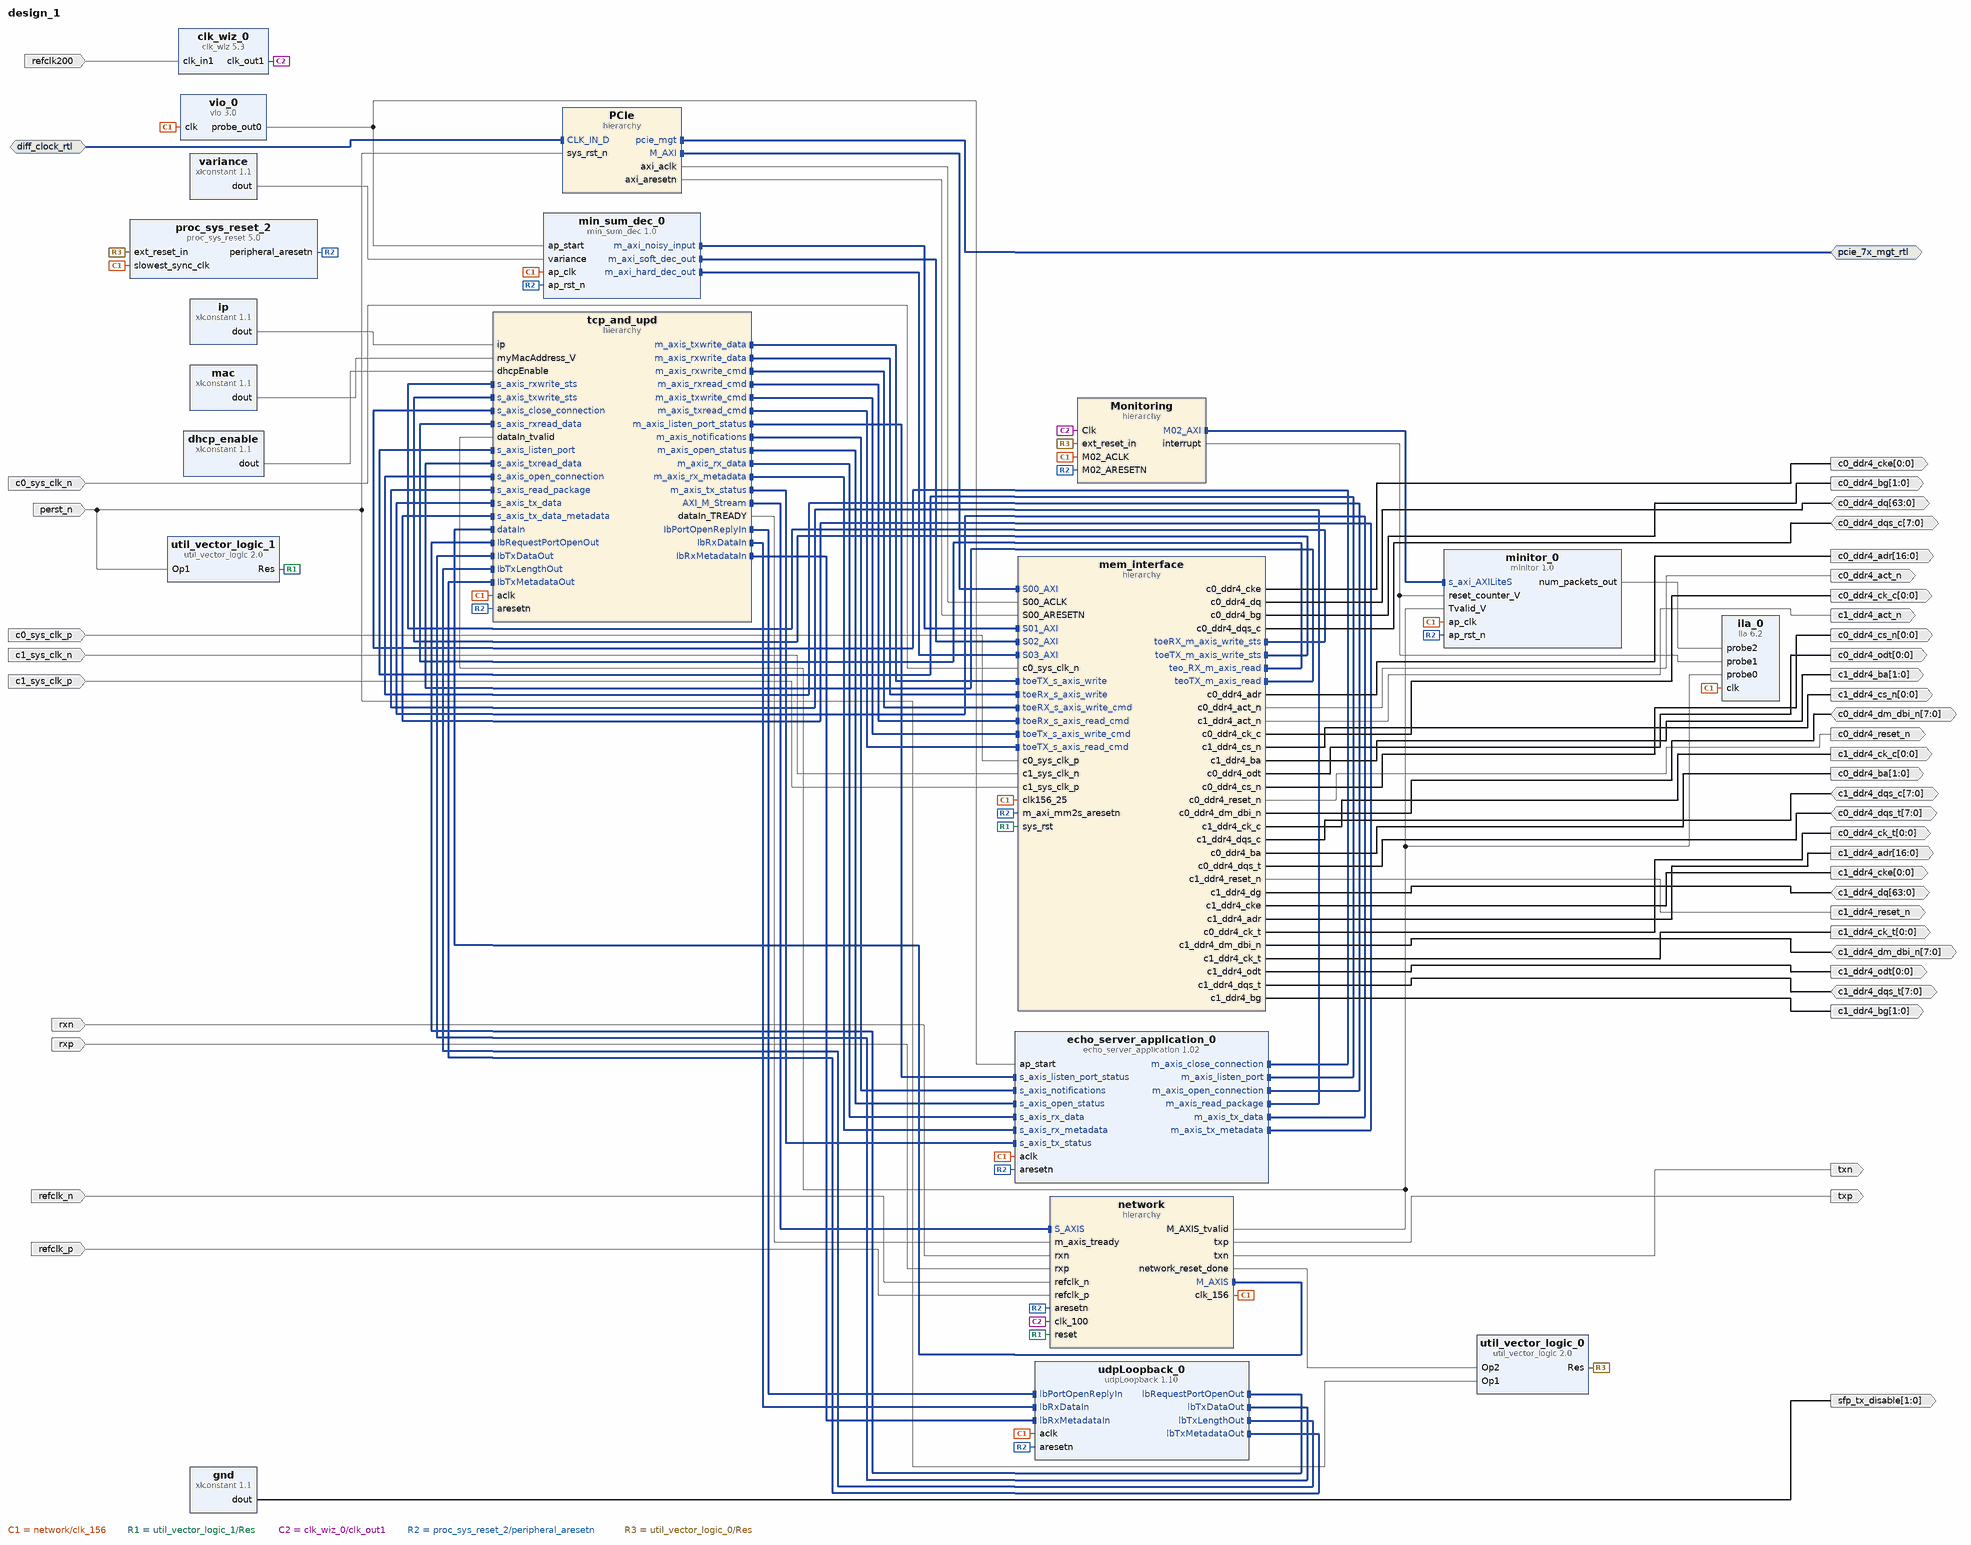
[diagram p0: block diagram of the top level]
# Vivado block design design_1, xcku115-flva1517-2-e, Vivado 2016.3
create_bd_design design_1

create_bd_intf_port -mode Master -vlnv xilinx.com:interface:pcie_7x_mgt_rtl:1.0 pcie_7x_mgt_rtl
create_bd_intf_port -mode Slave -vlnv xilinx.com:interface:diff_clock_rtl:1.0 diff_clock_rtl
set_property -dict {CONFIG.FREQ_HZ 100000000} [get_bd_intf_ports diff_clock_rtl]
create_bd_port -dir I rxn
create_bd_port -dir I rxp
create_bd_port -dir I refclk_n
create_bd_port -dir O txp
create_bd_port -dir O txn
create_bd_port -dir I refclk_p
create_bd_port -dir I perst_n
create_bd_port -dir I -type clk refclk200
set_property -dict {CONFIG.FREQ_HZ 200000000} [get_bd_ports refclk200]
create_bd_port -dir O -from 1 -to 0 sfp_tx_disable
create_bd_port -dir O -from 0 -to 0 c0_ddr4_cke
create_bd_port -dir IO -from 63 -to 0 c0_ddr4_dq
create_bd_port -dir IO -from 7 -to 0 c0_ddr4_dqs_c
create_bd_port -dir O c1_ddr4_reset_n
create_bd_port -dir IO -from 7 -to 0 c1_ddr4_dqs_c
create_bd_port -dir O -from 0 -to 0 c1_ddr4_cs_n
create_bd_port -dir O -from 1 -to 0 c0_ddr4_bg
create_bd_port -dir O c1_ddr4_act_n
create_bd_port -dir O -from 1 -to 0 c1_ddr4_ba
create_bd_port -dir I -type clk c0_sys_clk_n
create_bd_port -dir IO -from 63 -to 0 c1_ddr4_dq
create_bd_port -dir O -from 0 -to 0 -type clk c1_ddr4_ck_c
create_bd_port -dir O -from 0 -to 0 c1_ddr4_cke
create_bd_port -dir I -type clk c0_sys_clk_p
create_bd_port -dir O -from 16 -to 0 c0_ddr4_adr
create_bd_port -dir O -from 0 -to 0 c0_ddr4_odt
create_bd_port -dir O c0_ddr4_reset_n
create_bd_port -dir O c0_ddr4_act_n
create_bd_port -dir O -from 0 -to 0 -type clk c0_ddr4_ck_c
create_bd_port -dir I -type clk c1_sys_clk_n
create_bd_port -dir IO -from 7 -to 0 c1_ddr4_dm_dbi_n
create_bd_port -dir O -from 0 -to 0 c0_ddr4_cs_n
create_bd_port -dir O -from 16 -to 0 c1_ddr4_adr
create_bd_port -dir O -from 0 -to 0 c1_ddr4_odt
create_bd_port -dir IO -from 7 -to 0 c0_ddr4_dm_dbi_n
create_bd_port -dir O -from 0 -to 0 -type clk c1_ddr4_ck_t
create_bd_port -dir IO -from 7 -to 0 c0_ddr4_dqs_t
create_bd_port -dir I -type clk c1_sys_clk_p
create_bd_port -dir IO -from 7 -to 0 c1_ddr4_dqs_t
create_bd_port -dir O -from 1 -to 0 c1_ddr4_bg
create_bd_port -dir O -from 0 -to 0 -type clk c0_ddr4_ck_t
create_bd_port -dir O -from 1 -to 0 c0_ddr4_ba

create_bd_cell -type hier tcp_and_upd
create_bd_cell -type hier network
create_bd_cell -type ip -vlnv xilinx.labs:hls:echo_server_application:1.02 echo_server_application_0
create_bd_cell -type ip -vlnv xilinx.com:ip:util_vector_logic:2.0 util_vector_logic_0
set_property -dict {CONFIG.C_SIZE 1} [get_bd_cells util_vector_logic_0]
create_bd_cell -type ip -vlnv xilinx.com:ip:util_vector_logic:2.0 util_vector_logic_1
set_property -dict {CONFIG.C_SIZE 1 CONFIG.C_OPERATION not} [get_bd_cells util_vector_logic_1]
create_bd_cell -type ip -vlnv xilinx.com:ip:clk_wiz:5.3 clk_wiz_0
set_property -dict {CONFIG.USE_LOCKED false CONFIG.USE_RESET false} [get_bd_cells clk_wiz_0]
create_bd_cell -type ip -vlnv xilinx.com:ip:xlconstant:1.1 gnd
set_property -dict {CONFIG.CONST_WIDTH 2 CONFIG.CONST_VAL 0} [get_bd_cells gnd]
create_bd_cell -type ip -vlnv xilinx.com:ip:xlconstant:1.1 ip
set_property -dict {CONFIG.CONST_WIDTH 32 CONFIG.CONST_VAL 16843009} [get_bd_cells ip]
create_bd_cell -type ip -vlnv xilinx.com:ip:xlconstant:1.1 mac
set_property -dict {CONFIG.CONST_WIDTH 48 CONFIG.CONST_VAL 252462509656576} [get_bd_cells mac]
create_bd_cell -type ip -vlnv xilinx.com:ip:xlconstant:1.1 dhcp_enable
set_property -dict {CONFIG.CONST_VAL 0} [get_bd_cells dhcp_enable]
create_bd_cell -type ip -vlnv xilinx.com:ip:proc_sys_reset:5.0 proc_sys_reset_2
create_bd_cell -type ip -vlnv xilinx.com:ip:vio:3.0 vio_0
set_property -dict {CONFIG.C_NUM_PROBE_IN 0} [get_bd_cells vio_0]
create_bd_cell -type hier mem_interface
create_bd_cell -type hier PCIe
create_bd_cell -type hier Monitoring
create_bd_cell -type ip -vlnv xilinx.com:hls:min_sum_dec:1.0 min_sum_dec_0
set_property -dict [list \
  CONFIG.C_M_AXI_NOISY_INPUT_TARGET_ADDR 0x00000204 \
  CONFIG.C_M_AXI_SOFT_DEC_OUT_TARGET_ADDR 0x000011AC \
  CONFIG.C_M_AXI_HARD_DEC_OUT_TARGET_ADDR 0x00002154 \
] [get_bd_cells min_sum_dec_0]
create_bd_cell -type ip -vlnv xilinx.com:ip:xlconstant:1.1 variance
set_property -dict {CONFIG.CONST_WIDTH 32 CONFIG.CONST_VAL 1061902616} [get_bd_cells variance]
create_bd_cell -type ip -vlnv xilinx.labs:hls:udpLoopback:1.10 udpLoopback_0
create_bd_cell -type ip -vlnv xilinx.com:ip:ila:6.2 ila_0
set_property -dict [list \
  CONFIG.C_PROBE2_WIDTH 32 \
  CONFIG.C_NUM_OF_PROBES 3 \
  CONFIG.C_ENABLE_ILA_AXI_MON false \
  CONFIG.C_MONITOR_TYPE Native \
] [get_bd_cells ila_0]
create_bd_cell -type ip -vlnv xilinx.com:hls:minitor:1.0 minitor_0

# ---- hierarchy /tcp_and_upd ----
current_bd_instance /tcp_and_upd
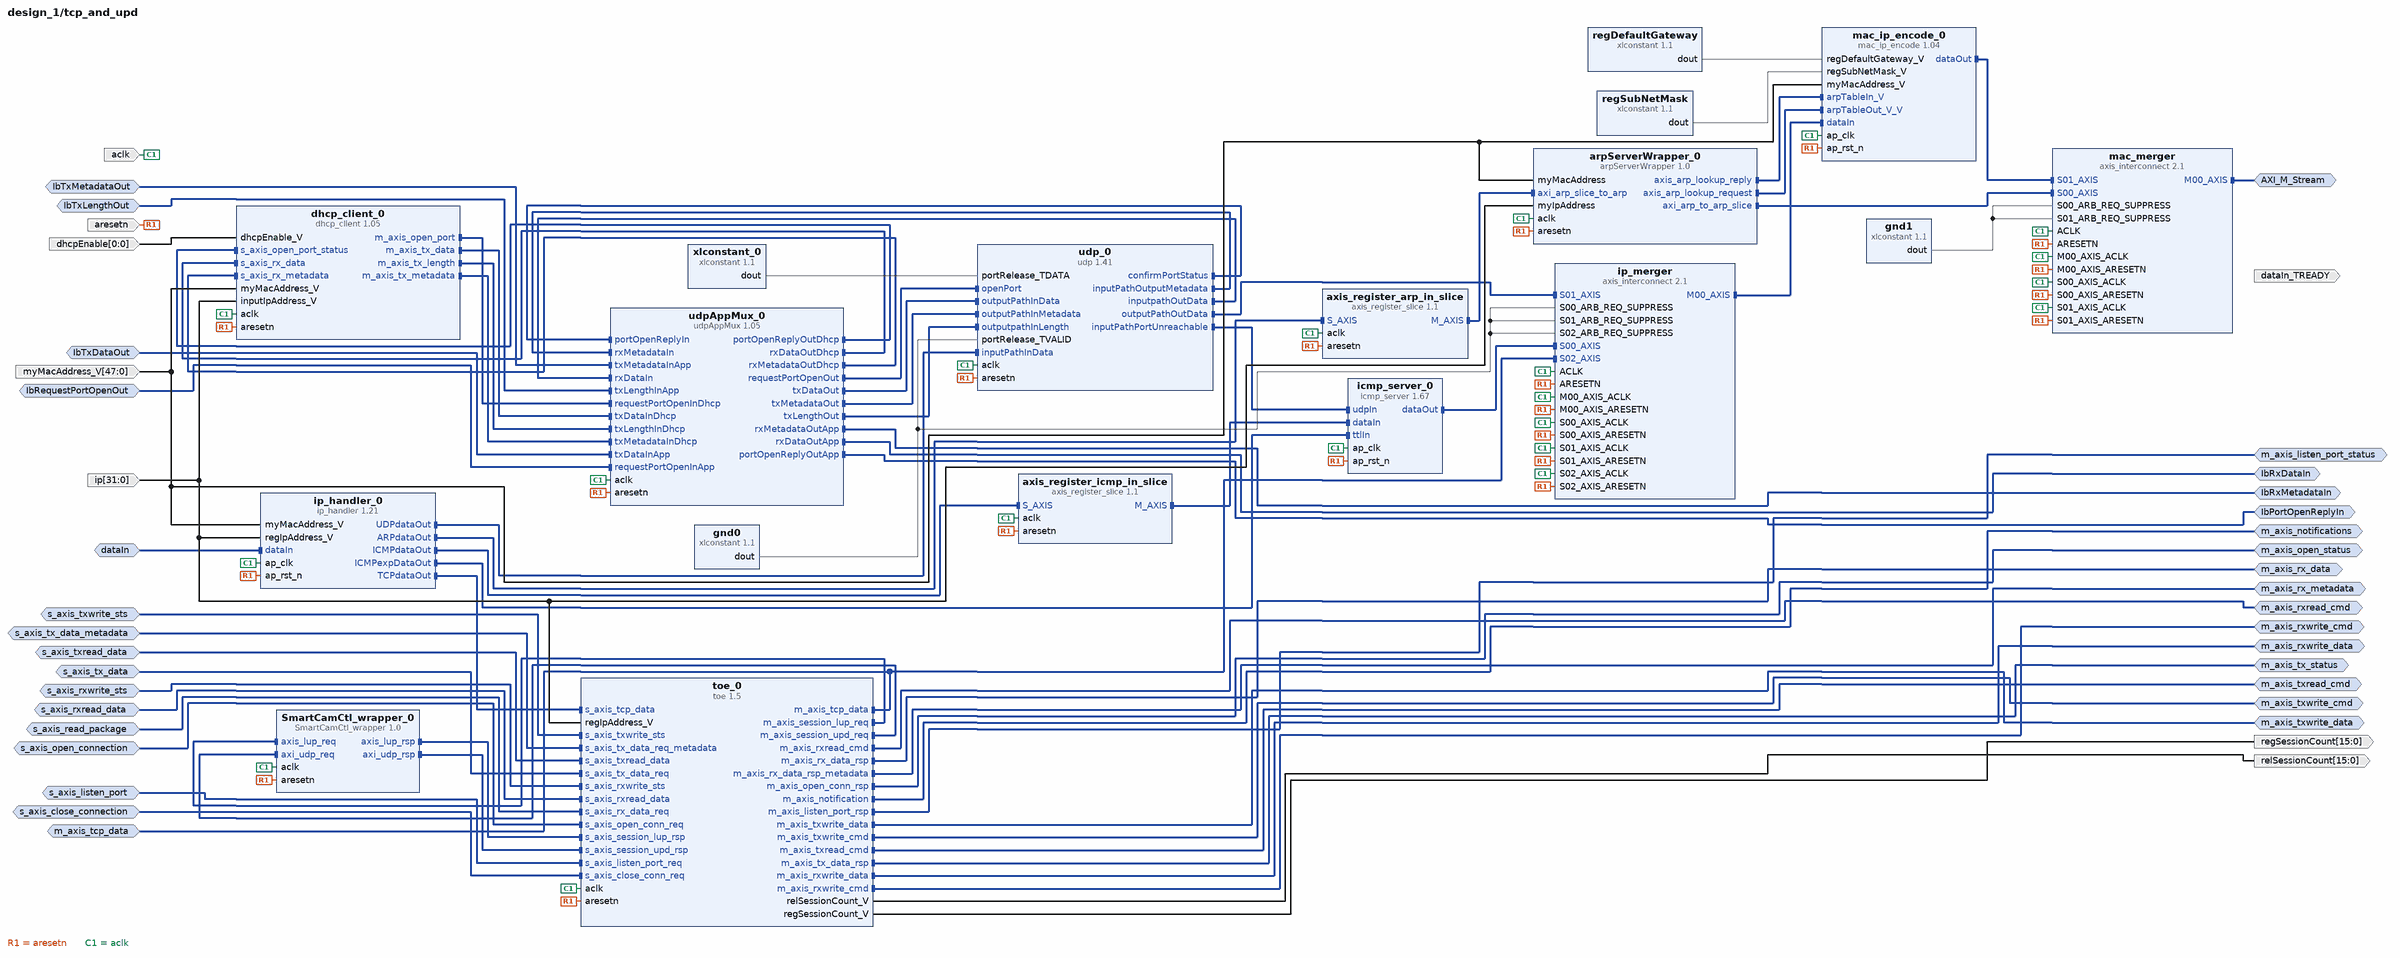
[diagram p1: block diagram inside /tcp_and_upd]
create_bd_intf_pin -mode Master -vlnv xilinx.com:interface:axis_rtl:1.0 m_axis_rxread_cmd
create_bd_intf_pin -mode Master -vlnv xilinx.com:interface:axis_rtl:1.0 m_axis_rx_data
create_bd_intf_pin -mode Master -vlnv xilinx.com:interface:axis_rtl:1.0 m_axis_rx_metadata
create_bd_intf_pin -mode Master -vlnv xilinx.com:interface:axis_rtl:1.0 m_axis_open_status
create_bd_intf_pin -mode Master -vlnv xilinx.com:interface:axis_rtl:1.0 m_axis_notifications
create_bd_intf_pin -mode Master -vlnv xilinx.com:interface:axis_rtl:1.0 m_axis_listen_port_status
create_bd_intf_pin -mode Slave -vlnv xilinx.com:interface:axis_rtl:1.0 s_axis_txwrite_sts
create_bd_intf_pin -mode Slave -vlnv xilinx.com:interface:axis_rtl:1.0 s_axis_tx_data_metadata
create_bd_intf_pin -mode Master -vlnv xilinx.com:interface:axis_rtl:1.0 m_axis_txwrite_data
create_bd_intf_pin -mode Master -vlnv xilinx.com:interface:axis_rtl:1.0 m_axis_txwrite_cmd
create_bd_intf_pin -mode Master -vlnv xilinx.com:interface:axis_rtl:1.0 m_axis_txread_cmd
create_bd_intf_pin -mode Master -vlnv xilinx.com:interface:axis_rtl:1.0 m_axis_tx_status
create_bd_intf_pin -mode Master -vlnv xilinx.com:interface:axis_rtl:1.0 m_axis_rxwrite_data
create_bd_intf_pin -mode Master -vlnv xilinx.com:interface:axis_rtl:1.0 m_axis_rxwrite_cmd
create_bd_intf_pin -mode Master -vlnv xilinx.com:interface:axis_rtl:1.0 IbRxMetadataIn
create_bd_intf_pin -mode Master -vlnv xilinx.com:interface:axis_rtl:1.0 IbRxDataIn
create_bd_intf_pin -mode Master -vlnv xilinx.com:interface:axis_rtl:1.0 IbPortOpenReplyIn
create_bd_intf_pin -mode Slave -vlnv xilinx.com:interface:axis_rtl:1.0 IbTxMetadataOut
create_bd_intf_pin -mode Slave -vlnv xilinx.com:interface:axis_rtl:1.0 IbTxLengthOut
create_bd_intf_pin -mode Slave -vlnv xilinx.com:interface:axis_rtl:1.0 IbTxDataOut
create_bd_intf_pin -mode Slave -vlnv xilinx.com:interface:axis_rtl:1.0 IbRequestPortOpenOut
create_bd_intf_pin -mode Slave -vlnv xilinx.com:interface:axis_rtl:1.0 s_axis_txread_data
create_bd_intf_pin -mode Slave -vlnv xilinx.com:interface:axis_rtl:1.0 s_axis_tx_data
create_bd_intf_pin -mode Slave -vlnv xilinx.com:interface:axis_rtl:1.0 s_axis_rxwrite_sts
create_bd_intf_pin -mode Slave -vlnv xilinx.com:interface:axis_rtl:1.0 s_axis_rxread_data
create_bd_intf_pin -mode Slave -vlnv xilinx.com:interface:axis_rtl:1.0 s_axis_read_package
create_bd_intf_pin -mode Slave -vlnv xilinx.com:interface:axis_rtl:1.0 s_axis_open_connection
create_bd_intf_pin -mode Slave -vlnv xilinx.com:interface:axis_rtl:1.0 s_axis_listen_port
create_bd_intf_pin -mode Slave -vlnv xilinx.com:interface:axis_rtl:1.0 s_axis_close_connection
create_bd_intf_pin -mode Master -vlnv xilinx.com:interface:axis_rtl:1.0 AXI_M_Stream
create_bd_intf_pin -mode Monitor -vlnv xilinx.com:interface:axis_rtl:1.0 m_axis_tcp_data
create_bd_intf_pin -mode Slave -vlnv xilinx.com:interface:axis_rtl:1.0 dataIn
create_bd_pin -dir I -type rst aresetn
create_bd_pin -dir I -type clk aclk
create_bd_pin -dir I -from 47 -to 0 myMacAddress_V
create_bd_pin -dir I -from 0 -to 0 dhcpEnable
create_bd_pin -dir O -from 15 -to 0 relSessionCount
create_bd_pin -dir I -from 31 -to 0 ip
create_bd_pin -dir O -from 15 -to 0 regSessionCount
create_bd_pin -dir O dataIn_TREADY

create_bd_cell -type ip -vlnv xilinx.com:ip:xlconstant:1.1 gnd1
set_property -dict {CONFIG.CONST_VAL 0} [get_bd_cells gnd1]
create_bd_cell -type ip -vlnv xilinx.labs:hls:udp:1.41 udp_0
create_bd_cell -type ip -vlnv xilinx.com:ip:axis_register_slice:1.1 axis_register_icmp_in_slice
create_bd_cell -type ip -vlnv xilinx.labs:hls:ip_handler:1.21 ip_handler_0
create_bd_cell -type ip -vlnv xilinx.com:ip:xlconstant:1.1 regDefaultGateway
set_property -dict {CONFIG.CONST_WIDTH 32 CONFIG.CONST_VAL 16843009} [get_bd_cells regDefaultGateway]
create_bd_cell -type ip -vlnv xilinx.com:ip:axis_interconnect:2.1 mac_merger
set_property -dict [list \
  CONFIG.NUM_SI 2 \
  CONFIG.NUM_MI 1 \
  CONFIG.HAS_ACLKEN 0 \
  CONFIG.ENABLE_ADVANCED_OPTIONS 1 \
  CONFIG.ENABLE_FIFO_COUNT_PORTS 0 \
  CONFIG.ARB_ON_MAX_XFERS 0 \
  CONFIG.ARB_ON_TLAST 1 \
  CONFIG.M00_HAS_REGSLICE 1 \
  CONFIG.S00_HAS_REGSLICE 1 \
  CONFIG.S01_HAS_REGSLICE 1 \
] [get_bd_cells mac_merger]
create_bd_cell -type ip -vlnv xilinx.labs:hls:udpAppMux:1.05 udpAppMux_0
create_bd_cell -type ip -vlnv xilinx.labs:hls:icmp_server:1.67 icmp_server_0
create_bd_cell -type ip -vlnv xilinx.labs:hls:dhcp_client:1.05 dhcp_client_0
create_bd_cell -type ip -vlnv xilinx.com:ip:xlconstant:1.1 regSubNetMask
set_property -dict {CONFIG.CONST_WIDTH 32 CONFIG.CONST_VAL 16777215} [get_bd_cells regSubNetMask]
create_bd_cell -type ip -vlnv xilinx.labs:hls:mac_ip_encode:1.04 mac_ip_encode_0
create_bd_cell -type ip -vlnv xilinx.com:ip:axis_register_slice:1.1 axis_register_arp_in_slice
create_bd_cell -type ip -vlnv xilinx.com:ip:xlconstant:1.1 gnd0
set_property -dict {CONFIG.CONST_VAL 0} [get_bd_cells gnd0]
create_bd_cell -type ip -vlnv xilinx.com:ip:axis_interconnect:2.1 ip_merger
set_property -dict [list \
  CONFIG.NUM_SI 3 \
  CONFIG.NUM_MI 1 \
  CONFIG.HAS_ACLKEN 0 \
  CONFIG.ENABLE_ADVANCED_OPTIONS 1 \
  CONFIG.ENABLE_FIFO_COUNT_PORTS 0 \
  CONFIG.ARB_ON_TLAST 1 \
  CONFIG.S00_HAS_REGSLICE 1 \
  CONFIG.S01_HAS_REGSLICE 1 \
  CONFIG.S02_HAS_REGSLICE 1 \
] [get_bd_cells ip_merger]
create_bd_cell -type ip -vlnv xilinx.labs:hls:toe:1.5 toe_0
create_bd_cell -type ip -vlnv xilinx.com:ip:xlconstant:1.1 xlconstant_0
set_property -dict {CONFIG.CONST_WIDTH 16} [get_bd_cells xlconstant_0]
create_bd_cell -type ip -vlnv user.org:user:arpServerWrapper:1.0 arpServerWrapper_0
create_bd_cell -type ip -vlnv user.org:user:SmartCamCtl_wrapper:1.0 SmartCamCtl_wrapper_0

# ---- hierarchy /network ----
current_bd_instance /network
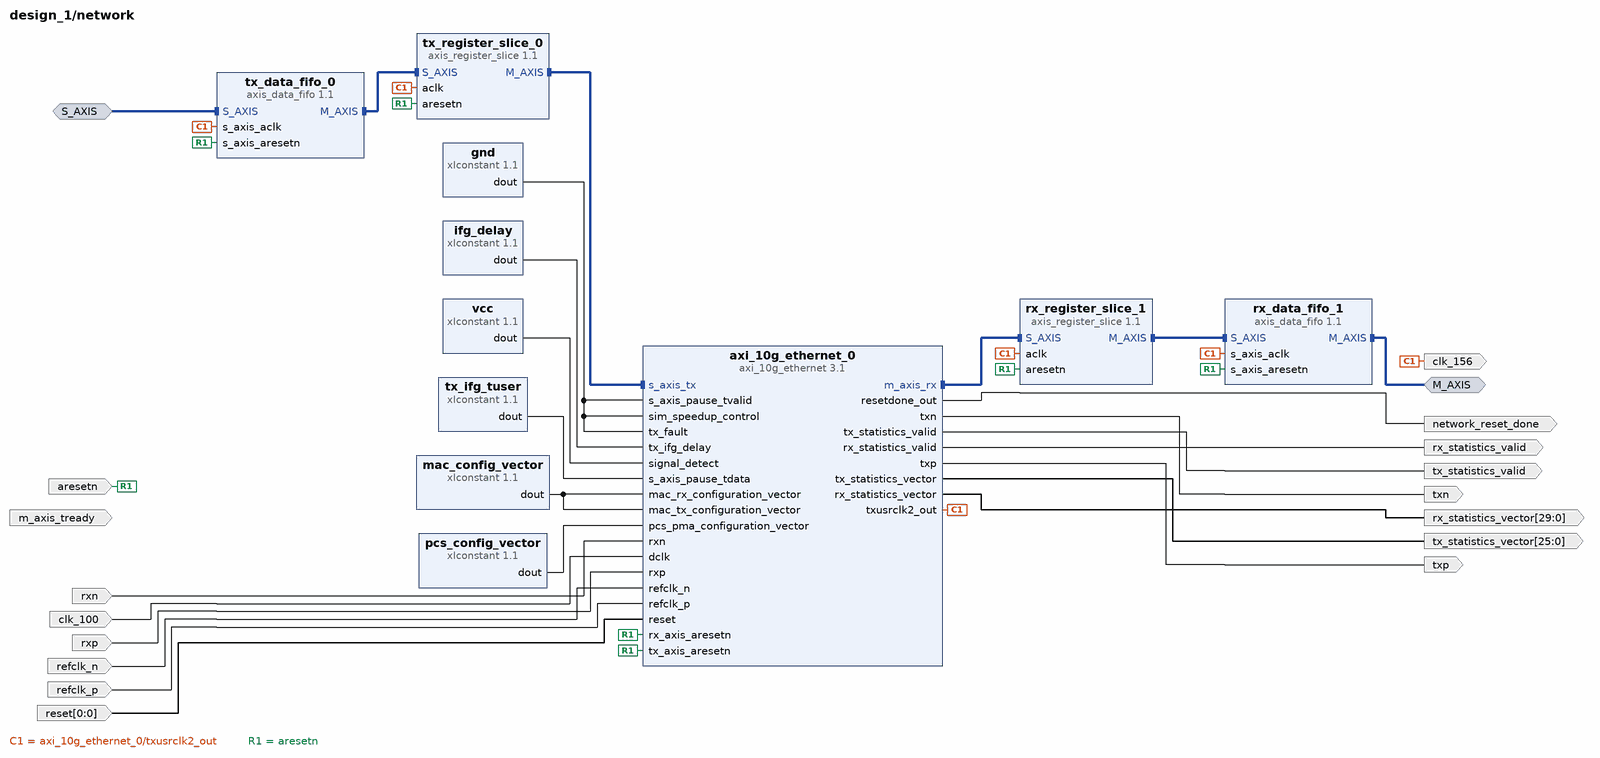
[diagram p2: block diagram inside /network]
create_bd_intf_pin -mode Slave -vlnv xilinx.com:interface:axis_rtl:1.0 S_AXIS
create_bd_intf_pin -mode Master -vlnv xilinx.com:interface:axis_rtl:1.0 M_AXIS
create_bd_pin -dir I rxn
create_bd_pin -dir I -type clk clk_100
create_bd_pin -dir I rxp
create_bd_pin -dir O -type clk clk_156
create_bd_pin -dir I -type rst aresetn
create_bd_pin -dir I refclk_n
create_bd_pin -dir O txp
create_bd_pin -dir O txn
create_bd_pin -dir O network_reset_done
create_bd_pin -dir I refclk_p
create_bd_pin -dir I -from 0 -to 0 -type rst reset
create_bd_pin -dir O tx_statistics_valid
create_bd_pin -dir O -from 25 -to 0 tx_statistics_vector
create_bd_pin -dir O rx_statistics_valid
create_bd_pin -dir O -from 29 -to 0 rx_statistics_vector
create_bd_pin -dir I m_axis_tready

create_bd_cell -type ip -vlnv xilinx.com:ip:xlconstant:1.1 gnd
set_property -dict {CONFIG.CONST_VAL 0} [get_bd_cells gnd]
create_bd_cell -type ip -vlnv xilinx.com:ip:axis_register_slice:1.1 tx_register_slice_0
set_property -dict {CONFIG.TUSER_WIDTH 0} [get_bd_cells tx_register_slice_0]
create_bd_cell -type ip -vlnv xilinx.com:ip:axi_10g_ethernet:3.1 axi_10g_ethernet_0
set_property -dict [list \
  CONFIG.Management_Interface false \
  CONFIG.base_kr BASE-R \
  CONFIG.SupportLevel 1 \
  CONFIG.Locations X1Y16 \
] [get_bd_cells axi_10g_ethernet_0]
create_bd_cell -type ip -vlnv xilinx.com:ip:xlconstant:1.1 mac_config_vector
set_property -dict {CONFIG.CONST_WIDTH 80 CONFIG.CONST_VAL 22} [get_bd_cells mac_config_vector]
create_bd_cell -type ip -vlnv xilinx.com:ip:xlconstant:1.1 tx_ifg_tuser
set_property -dict {CONFIG.CONST_WIDTH 16 CONFIG.CONST_VAL 0} [get_bd_cells tx_ifg_tuser]
create_bd_cell -type ip -vlnv xilinx.com:ip:xlconstant:1.1 ifg_delay
set_property -dict {CONFIG.CONST_WIDTH 8 CONFIG.CONST_VAL 0} [get_bd_cells ifg_delay]
create_bd_cell -type ip -vlnv xilinx.com:ip:xlconstant:1.1 vcc
create_bd_cell -type ip -vlnv xilinx.com:ip:xlconstant:1.1 pcs_config_vector
set_property -dict {CONFIG.CONST_WIDTH 536 CONFIG.CONST_VAL 0} [get_bd_cells pcs_config_vector]
create_bd_cell -type ip -vlnv xilinx.com:ip:axis_register_slice:1.1 rx_register_slice_1
set_property -dict {CONFIG.TUSER_WIDTH 0} [get_bd_cells rx_register_slice_1]
create_bd_cell -type ip -vlnv xilinx.com:ip:axis_data_fifo:1.1 rx_data_fifo_1
set_property -dict {CONFIG.FIFO_MODE 2} [get_bd_cells rx_data_fifo_1]
create_bd_cell -type ip -vlnv xilinx.com:ip:axis_data_fifo:1.1 tx_data_fifo_0
set_property -dict {CONFIG.FIFO_MODE 2} [get_bd_cells tx_data_fifo_0]

# ---- hierarchy /mem_interface ----
current_bd_instance /mem_interface
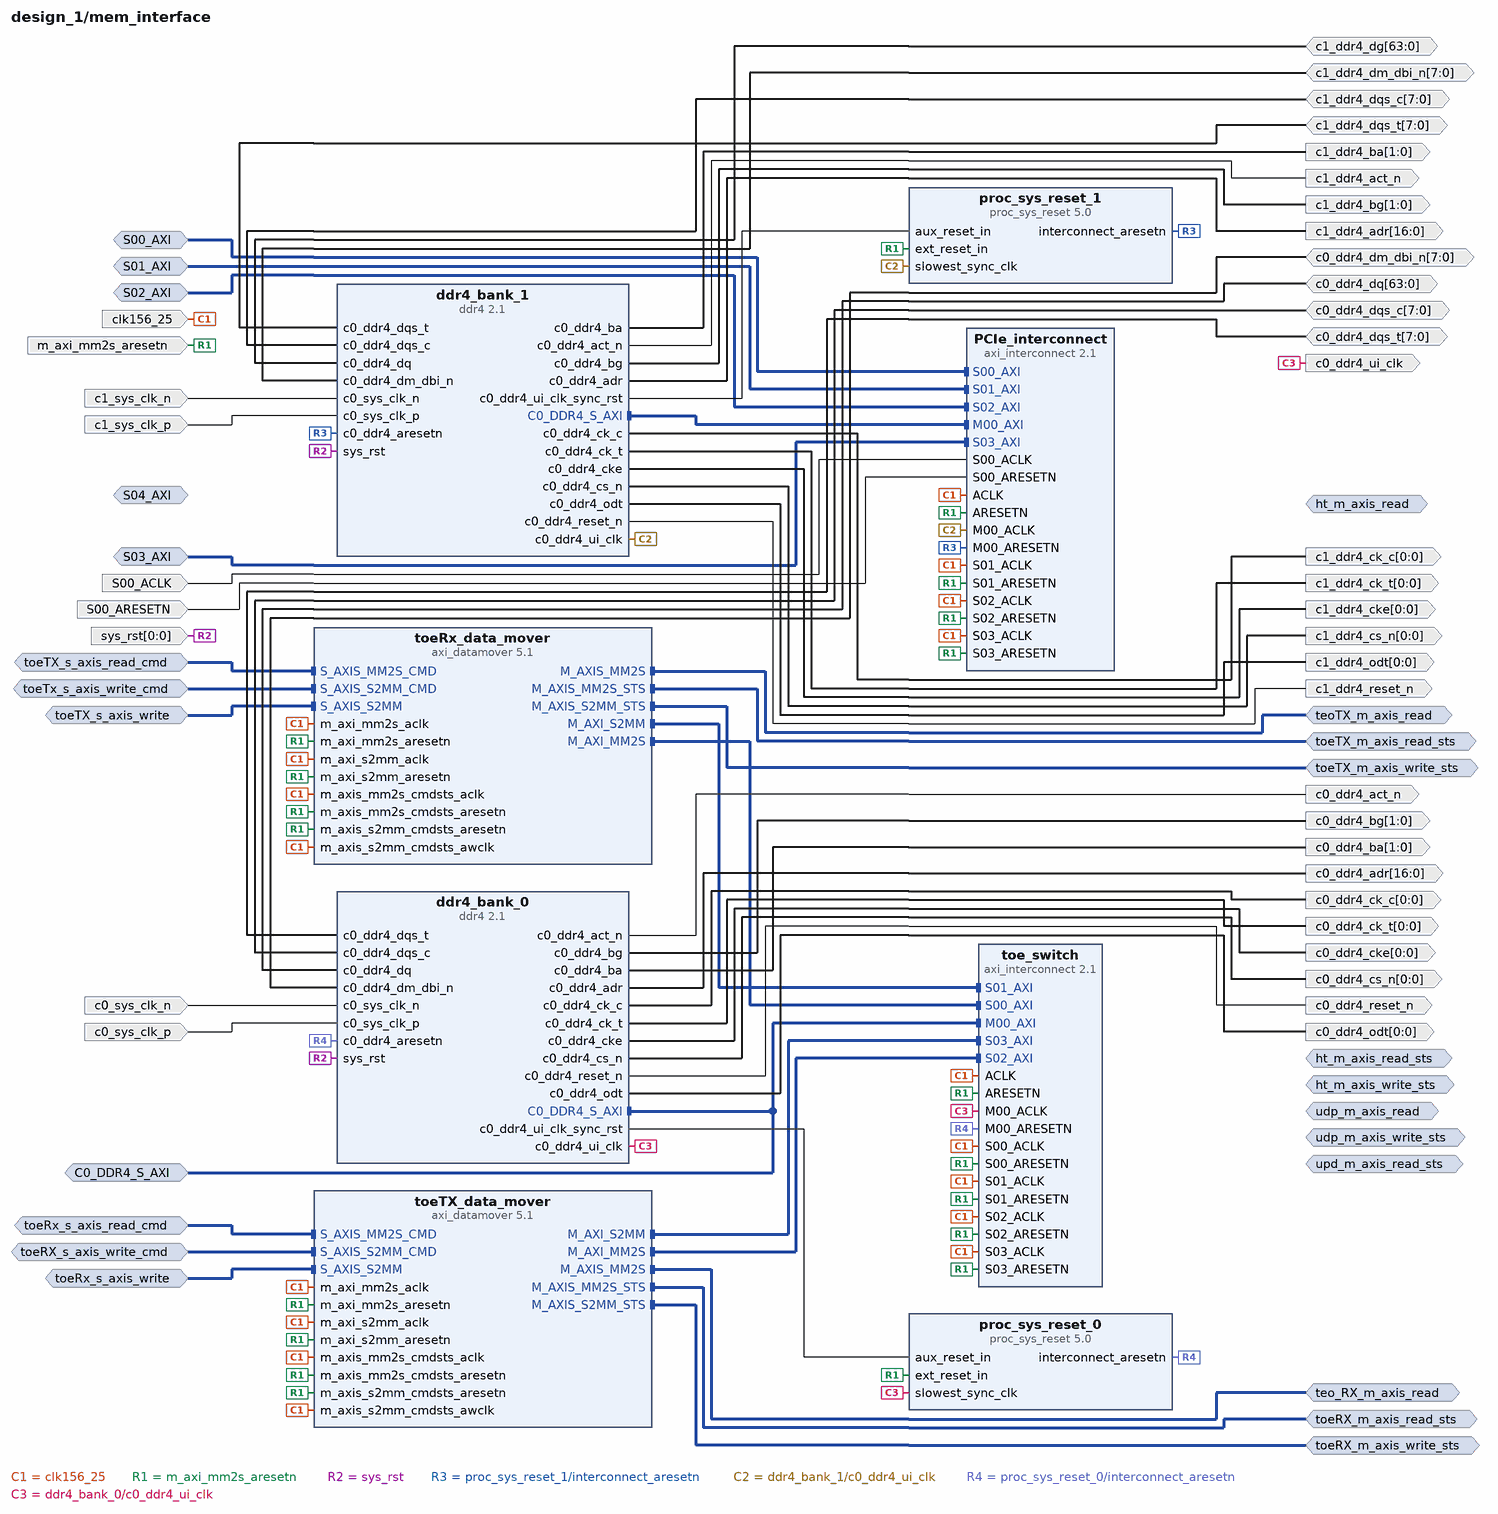
[diagram p3: block diagram inside /mem_interface]
create_bd_intf_pin -mode Master -vlnv xilinx.com:interface:axis_rtl:1.0 teoTX_m_axis_read
create_bd_intf_pin -mode Master -vlnv xilinx.com:interface:axis_rtl:1.0 toeTX_m_axis_read_sts
create_bd_intf_pin -mode Slave -vlnv xilinx.com:interface:axis_rtl:1.0 toeTX_s_axis_read_cmd
create_bd_intf_pin -mode Master -vlnv xilinx.com:interface:axis_rtl:1.0 toeTX_m_axis_write_sts
create_bd_intf_pin -mode Slave -vlnv xilinx.com:interface:axis_rtl:1.0 toeTx_s_axis_write_cmd
create_bd_intf_pin -mode Slave -vlnv xilinx.com:interface:axis_rtl:1.0 toeTX_s_axis_write
create_bd_intf_pin -mode Master -vlnv xilinx.com:interface:axis_rtl:1.0 udp_m_axis_read
create_bd_intf_pin -mode Master -vlnv xilinx.com:interface:axis_rtl:1.0 upd_m_axis_read_sts
create_bd_intf_pin -mode Master -vlnv xilinx.com:interface:axis_rtl:1.0 udp_m_axis_write_sts
create_bd_intf_pin -mode Master -vlnv xilinx.com:interface:axis_rtl:1.0 ht_m_axis_read
create_bd_intf_pin -mode Master -vlnv xilinx.com:interface:axis_rtl:1.0 ht_m_axis_read_sts
create_bd_intf_pin -mode Master -vlnv xilinx.com:interface:axis_rtl:1.0 ht_m_axis_write_sts
create_bd_intf_pin -mode Master -vlnv xilinx.com:interface:axis_rtl:1.0 teo_RX_m_axis_read
create_bd_intf_pin -mode Master -vlnv xilinx.com:interface:axis_rtl:1.0 toeRX_m_axis_read_sts
create_bd_intf_pin -mode Slave -vlnv xilinx.com:interface:axis_rtl:1.0 toeRx_s_axis_read_cmd
create_bd_intf_pin -mode Master -vlnv xilinx.com:interface:axis_rtl:1.0 toeRX_m_axis_write_sts
create_bd_intf_pin -mode Slave -vlnv xilinx.com:interface:axis_rtl:1.0 toeRX_s_axis_write_cmd
create_bd_intf_pin -mode Slave -vlnv xilinx.com:interface:axis_rtl:1.0 toeRx_s_axis_write
create_bd_intf_pin -mode Monitor -vlnv xilinx.com:interface:aximm_rtl:1.0 C0_DDR4_S_AXI
create_bd_intf_pin -mode Slave -vlnv xilinx.com:interface:aximm_rtl:1.0 S00_AXI
create_bd_intf_pin -mode Slave -vlnv xilinx.com:interface:aximm_rtl:1.0 S01_AXI
create_bd_intf_pin -mode Slave -vlnv xilinx.com:interface:aximm_rtl:1.0 S02_AXI
create_bd_intf_pin -mode Slave -vlnv xilinx.com:interface:aximm_rtl:1.0 S03_AXI
create_bd_intf_pin -mode Slave -vlnv xilinx.com:interface:aximm_rtl:1.0 S04_AXI
create_bd_pin -dir I -type clk clk156_25
create_bd_pin -dir O c0_ddr4_act_n
create_bd_pin -dir O -from 1 -to 0 c0_ddr4_bg
create_bd_pin -dir O c0_ddr4_reset_n
create_bd_pin -dir O -from 1 -to 0 c0_ddr4_ba
create_bd_pin -dir O -from 0 -to 0 c0_ddr4_odt
create_bd_pin -dir O -from 16 -to 0 c0_ddr4_adr
create_bd_pin -dir O -from 0 -to 0 c0_ddr4_cs_n
create_bd_pin -dir O -from 0 -to 0 c0_ddr4_cke
create_bd_pin -dir O -from 0 -to 0 -type clk c0_ddr4_ck_t
create_bd_pin -dir O -from 0 -to 0 -type clk c0_ddr4_ck_c
create_bd_pin -dir IO -from 7 -to 0 c0_ddr4_dqs_t
create_bd_pin -dir IO -from 7 -to 0 c0_ddr4_dqs_c
create_bd_pin -dir IO -from 63 -to 0 c0_ddr4_dq
create_bd_pin -dir IO -from 7 -to 0 c0_ddr4_dm_dbi_n
create_bd_pin -dir O -from 1 -to 0 c1_ddr4_bg
create_bd_pin -dir O -from 1 -to 0 c1_ddr4_ba
create_bd_pin -dir O -from 0 -to 0 c1_ddr4_odt
create_bd_pin -dir O -from 16 -to 0 c1_ddr4_adr
create_bd_pin -dir O c1_ddr4_act_n
create_bd_pin -dir O -from 0 -to 0 c1_ddr4_cs_n
create_bd_pin -dir O -from 0 -to 0 c1_ddr4_cke
create_bd_pin -dir O -from 0 -to 0 -type clk c1_ddr4_ck_t
create_bd_pin -dir O -from 0 -to 0 -type clk c1_ddr4_ck_c
create_bd_pin -dir IO -from 7 -to 0 c1_ddr4_dqs_t
create_bd_pin -dir IO -from 7 -to 0 c1_ddr4_dqs_c
create_bd_pin -dir IO -from 63 -to 0 c1_ddr4_dg
create_bd_pin -dir IO -from 7 -to 0 c1_ddr4_dm_dbi_n
create_bd_pin -dir O c1_ddr4_reset_n
create_bd_pin -dir I -from 0 -to 0 -type rst sys_rst
create_bd_pin -dir I -type clk c1_sys_clk_n
create_bd_pin -dir I -type clk c1_sys_clk_p
create_bd_pin -dir I -type clk c0_sys_clk_n
create_bd_pin -dir I -type clk c0_sys_clk_p
create_bd_pin -dir I -type rst m_axi_mm2s_aresetn
create_bd_pin -dir O -type clk c0_ddr4_ui_clk
create_bd_pin -dir I -type clk S00_ACLK
create_bd_pin -dir I -type rst S00_ARESETN

create_bd_cell -type ip -vlnv xilinx.com:ip:ddr4:2.1 ddr4_bank_1
set_property -dict [list \
  CONFIG.C0.DDR4_TimePeriod 939 \
  CONFIG.C0.DDR4_InputClockPeriod 3338 \
  CONFIG.C0.DDR4_MemoryPart CUSTOM_DBI_MT40A1G8PM-083E \
  CONFIG.C0.DDR4_DataWidth 64 \
  CONFIG.C0.DDR4_CasLatency 18 \
  CONFIG.C0.DDR4_CasWriteLatency 11 \
  CONFIG.C0.DDR4_AxiDataWidth 512 \
  CONFIG.C0.DDR4_AxiAddressWidth 33 \
  CONFIG.C0.DDR4_CustomParts ../../../constraints/custom_parts_2133.csv \
  CONFIG.C0.DDR4_isCustom true \
  CONFIG.Simulation_Mode Unisim \
] [get_bd_cells ddr4_bank_1]
create_bd_cell -type ip -vlnv xilinx.com:ip:ddr4:2.1 ddr4_bank_0
set_property -dict [list \
  CONFIG.C0.DDR4_TimePeriod 939 \
  CONFIG.C0.DDR4_InputClockPeriod 3338 \
  CONFIG.C0.DDR4_Specify_MandD false \
  CONFIG.C0.DDR4_MemoryPart CUSTOM_DBI_MT40A1G8PM-083E \
  CONFIG.C0.DDR4_DataWidth 64 \
  CONFIG.C0.DDR4_CasLatency 18 \
  CONFIG.C0.DDR4_CasWriteLatency 11 \
  CONFIG.C0.DDR4_AxiDataWidth 512 \
  CONFIG.C0.DDR4_AxiAddressWidth 33 \
  CONFIG.C0.DDR4_CustomParts ../../../constraints/custom_parts_2133.csv \
  CONFIG.C0.DDR4_isCustom true \
  CONFIG.Simulation_Mode Unisim \
] [get_bd_cells ddr4_bank_0]
create_bd_cell -type ip -vlnv xilinx.com:ip:axi_datamover:5.1 toeRx_data_mover
set_property -dict [list \
  CONFIG.c_m_axi_mm2s_data_width 512 \
  CONFIG.c_m_axis_mm2s_tdata_width 64 \
  CONFIG.c_include_mm2s_dre true \
  CONFIG.c_mm2s_burst_size 16 \
  CONFIG.c_m_axi_s2mm_data_width 512 \
  CONFIG.c_include_s2mm_dre true \
] [get_bd_cells toeRx_data_mover]
create_bd_cell -type ip -vlnv xilinx.com:ip:proc_sys_reset:5.0 proc_sys_reset_1
create_bd_cell -type ip -vlnv xilinx.com:ip:proc_sys_reset:5.0 proc_sys_reset_0
create_bd_cell -type ip -vlnv xilinx.com:ip:axi_datamover:5.1 toeTX_data_mover
set_property -dict [list \
  CONFIG.c_m_axi_mm2s_data_width 512 \
  CONFIG.c_m_axis_mm2s_tdata_width 64 \
  CONFIG.c_include_mm2s_dre true \
  CONFIG.c_mm2s_burst_size 16 \
  CONFIG.c_m_axi_s2mm_data_width 512 \
  CONFIG.c_include_s2mm_dre true \
] [get_bd_cells toeTX_data_mover]
create_bd_cell -type ip -vlnv xilinx.com:ip:axi_interconnect:2.1 toe_switch
set_property -dict [list \
  CONFIG.NUM_SI 4 \
  CONFIG.NUM_MI 1 \
  CONFIG.ENABLE_ADVANCED_OPTIONS 1 \
  CONFIG.XBAR_DATA_WIDTH 512 \
  CONFIG.SYNCHRONIZATION_STAGES 3 \
  CONFIG.M00_HAS_REGSLICE 3 \
  CONFIG.S00_HAS_REGSLICE 3 \
  CONFIG.S01_HAS_REGSLICE 3 \
  CONFIG.S02_HAS_REGSLICE 3 \
  CONFIG.S03_HAS_REGSLICE 3 \
] [get_bd_cells toe_switch]
create_bd_cell -type ip -vlnv xilinx.com:ip:axi_interconnect:2.1 PCIe_interconnect
set_property -dict [list \
  CONFIG.NUM_SI 4 \
  CONFIG.NUM_MI 1 \
  CONFIG.ENABLE_ADVANCED_OPTIONS 1 \
  CONFIG.XBAR_DATA_WIDTH 512 \
  CONFIG.SYNCHRONIZATION_STAGES 3 \
  CONFIG.M00_HAS_REGSLICE 3 \
  CONFIG.S00_HAS_REGSLICE 3 \
  CONFIG.S01_HAS_REGSLICE 3 \
  CONFIG.S02_HAS_REGSLICE 3 \
  CONFIG.S03_HAS_REGSLICE 3 \
] [get_bd_cells PCIe_interconnect]

# ---- hierarchy /PCIe ----
current_bd_instance /PCIe
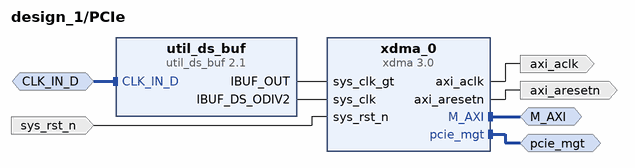
[diagram p4: block diagram inside /PCIe]
create_bd_intf_pin -mode Master -vlnv xilinx.com:interface:pcie_7x_mgt_rtl:1.0 pcie_mgt
create_bd_intf_pin -mode Master -vlnv xilinx.com:interface:aximm_rtl:1.0 M_AXI
create_bd_intf_pin -mode Slave -vlnv xilinx.com:interface:diff_clock_rtl:1.0 CLK_IN_D
create_bd_pin -dir I -type rst sys_rst_n
create_bd_pin -dir O -type clk axi_aclk
create_bd_pin -dir O -type rst axi_aresetn

create_bd_cell -type ip -vlnv xilinx.com:ip:xdma:3.0 xdma_0
set_property -dict [list \
  CONFIG.mode_selection Advanced \
  CONFIG.pl_link_cap_max_link_width X8 \
  CONFIG.pl_link_cap_max_link_speed 8.0_GT/s \
  CONFIG.axi_data_width 256_bit \
  CONFIG.axisten_freq 250 \
  CONFIG.pf0_device_id 8038 \
  CONFIG.pf0_interrupt_pin NONE \
  CONFIG.xdma_rnum_chnl 4 \
  CONFIG.xdma_wnum_chnl 4 \
  CONFIG.INS_LOSS_NYQ 5 \
  CONFIG.xdma_axi_intf_mm AXI_Memory_Mapped \
  CONFIG.cfg_mgmt_if false \
  CONFIG.ins_loss_profile Chip-to-Chip \
] [get_bd_cells xdma_0]
create_bd_cell -type ip -vlnv xilinx.com:ip:util_ds_buf:2.1 util_ds_buf
set_property -dict {CONFIG.C_BUF_TYPE IBUFDSGTE} [get_bd_cells util_ds_buf]

# ---- hierarchy /Monitoring ----
current_bd_instance /Monitoring
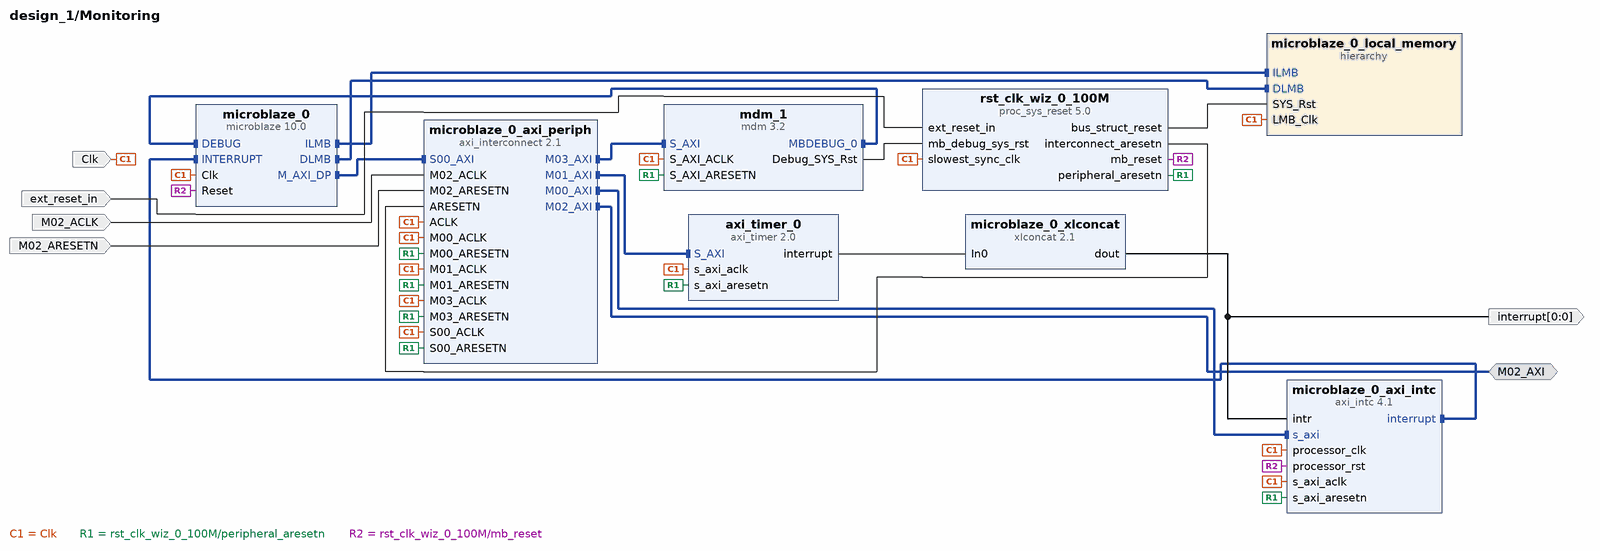
[diagram p5: block diagram inside /Monitoring]
create_bd_intf_pin -mode Master -vlnv xilinx.com:interface:aximm_rtl:1.0 M02_AXI
create_bd_pin -dir I -type clk Clk
create_bd_pin -dir I -type rst ext_reset_in
create_bd_pin -dir I -type clk M02_ACLK
create_bd_pin -dir I -type rst M02_ARESETN
create_bd_pin -dir O -from 0 -to 0 interrupt

create_bd_cell -type ip -vlnv xilinx.com:ip:microblaze:10.0 microblaze_0
set_property -dict [list \
  CONFIG.C_D_AXI 1 \
  CONFIG.C_D_LMB 1 \
  CONFIG.C_I_LMB 1 \
  CONFIG.C_DEBUG_ENABLED 1 \
  CONFIG.C_USE_ICACHE 0 \
  CONFIG.C_USE_DCACHE 0 \
] [get_bd_cells microblaze_0]
create_bd_cell -type ip -vlnv xilinx.com:ip:mdm:3.2 mdm_1
set_property -dict {CONFIG.C_USE_UART 1} [get_bd_cells mdm_1]
create_bd_cell -type ip -vlnv xilinx.com:ip:axi_timer:2.0 axi_timer_0
create_bd_cell -type ip -vlnv xilinx.com:ip:proc_sys_reset:5.0 rst_clk_wiz_0_100M
create_bd_cell -type ip -vlnv xilinx.com:ip:axi_interconnect:2.1 microblaze_0_axi_periph
set_property -dict {CONFIG.NUM_MI 4} [get_bd_cells microblaze_0_axi_periph]
create_bd_cell -type ip -vlnv xilinx.com:ip:xlconcat:2.1 microblaze_0_xlconcat
set_property -dict {CONFIG.NUM_PORTS 1} [get_bd_cells microblaze_0_xlconcat]
create_bd_cell -type hier microblaze_0_local_memory
create_bd_cell -type ip -vlnv xilinx.com:ip:axi_intc:4.1 microblaze_0_axi_intc
set_property -dict {CONFIG.C_HAS_FAST 1} [get_bd_cells microblaze_0_axi_intc]

# ---- hierarchy /Monitoring/microblaze_0_local_memory ----
current_bd_instance /Monitoring/microblaze_0_local_memory
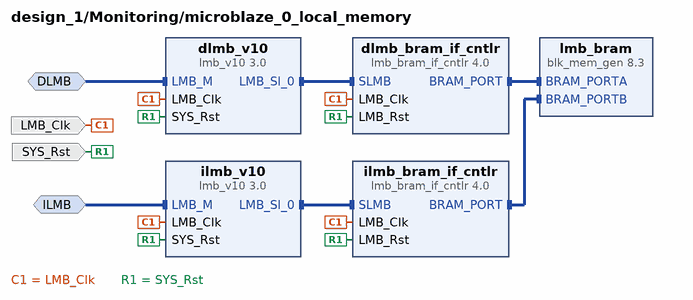
[diagram p6: block diagram inside /Monitoring/microblaze_0_local_memory]
create_bd_intf_pin -mode MirroredMaster -vlnv xilinx.com:interface:lmb_rtl:1.0 DLMB
create_bd_intf_pin -mode MirroredMaster -vlnv xilinx.com:interface:lmb_rtl:1.0 ILMB
create_bd_pin -dir I -type clk LMB_Clk
create_bd_pin -dir I -type rst SYS_Rst

create_bd_cell -type ip -vlnv xilinx.com:ip:lmb_v10:3.0 dlmb_v10
create_bd_cell -type ip -vlnv xilinx.com:ip:lmb_v10:3.0 ilmb_v10
create_bd_cell -type ip -vlnv xilinx.com:ip:lmb_bram_if_cntlr:4.0 dlmb_bram_if_cntlr
set_property -dict {CONFIG.C_ECC 0} [get_bd_cells dlmb_bram_if_cntlr]
create_bd_cell -type ip -vlnv xilinx.com:ip:lmb_bram_if_cntlr:4.0 ilmb_bram_if_cntlr
set_property -dict {CONFIG.C_ECC 0} [get_bd_cells ilmb_bram_if_cntlr]
create_bd_cell -type ip -vlnv xilinx.com:ip:blk_mem_gen:8.3 lmb_bram
set_property -dict {CONFIG.Memory_Type True_Dual_Port_RAM CONFIG.use_bram_block BRAM_Controller} [get_bd_cells lmb_bram]

# ---- connections ----

current_bd_instance /tcp_and_upd
connect_bd_intf_net [get_bd_intf_pins udp_0/confirmPortStatus] [get_bd_intf_pins udpAppMux_0/portOpenReplyIn]
connect_bd_intf_net [get_bd_intf_pins udp_0/inputPathInData] [get_bd_intf_pins ip_handler_0/UDPdataOut]
connect_bd_intf_net [get_bd_intf_pins udpAppMux_0/rxMetadataIn] [get_bd_intf_pins udp_0/inputPathOutputMetadata]
connect_bd_intf_net [get_bd_intf_pins icmp_server_0/udpIn] [get_bd_intf_pins udp_0/inputPathPortUnreachable]
connect_bd_intf_net [get_bd_intf_pins udpAppMux_0/rxDataIn] [get_bd_intf_pins udp_0/inputpathOutData]
connect_bd_intf_net [get_bd_intf_pins udpAppMux_0/requestPortOpenOut] [get_bd_intf_pins udp_0/openPort]
connect_bd_intf_net [get_bd_intf_pins udp_0/outputPathInData] [get_bd_intf_pins udpAppMux_0/txDataOut]
connect_bd_intf_net [get_bd_intf_pins udpAppMux_0/txMetadataOut] [get_bd_intf_pins udp_0/outputPathInMetadata]
connect_bd_intf_net [get_bd_intf_pins udp_0/outputPathOutData] [get_bd_intf_pins ip_merger/S01_AXIS]
connect_bd_intf_net [get_bd_intf_pins udpAppMux_0/txLengthOut] [get_bd_intf_pins udp_0/outputpathInLength]
connect_bd_intf_net [get_bd_intf_pins axis_register_icmp_in_slice/S_AXIS] [get_bd_intf_pins ip_handler_0/ICMPdataOut]
connect_bd_intf_net [get_bd_intf_pins axis_register_icmp_in_slice/M_AXIS] [get_bd_intf_pins icmp_server_0/dataIn]
connect_bd_intf_net [get_bd_intf_pins ip_handler_0/ARPdataOut] [get_bd_intf_pins axis_register_arp_in_slice/S_AXIS]
connect_bd_intf_net [get_bd_intf_pins ip_handler_0/ICMPexpDataOut] [get_bd_intf_pins icmp_server_0/ttlIn]
connect_bd_intf_net [get_bd_intf_pins ip_handler_0/TCPdataOut] [get_bd_intf_pins toe_0/s_axis_tcp_data]
connect_bd_intf_net [get_bd_intf_pins axis_register_arp_in_slice/M_AXIS] [get_bd_intf_pins arpServerWrapper_0/axi_arp_slice_to_arp]
connect_bd_intf_net [get_bd_intf_pins mac_merger/S00_AXIS] [get_bd_intf_pins arpServerWrapper_0/axi_arp_to_arp_slice]
connect_bd_intf_net [get_bd_intf_pins arpServerWrapper_0/axis_arp_lookup_reply] [get_bd_intf_pins mac_ip_encode_0/arpTableIn_V]
connect_bd_intf_net [get_bd_intf_pins arpServerWrapper_0/axis_arp_lookup_request] [get_bd_intf_pins mac_ip_encode_0/arpTableOut_V_V]
connect_bd_intf_net [get_bd_intf_pins mac_ip_encode_0/dataOut] [get_bd_intf_pins mac_merger/S01_AXIS]
connect_bd_intf_net [get_bd_intf_pins dhcp_client_0/s_axis_open_port_status] [get_bd_intf_pins udpAppMux_0/portOpenReplyOutDhcp]
connect_bd_intf_net [get_bd_intf_pins dhcp_client_0/m_axis_open_port] [get_bd_intf_pins udpAppMux_0/requestPortOpenInDhcp]
connect_bd_intf_net [get_bd_intf_pins udpAppMux_0/rxDataOutDhcp] [get_bd_intf_pins dhcp_client_0/s_axis_rx_data]
connect_bd_intf_net [get_bd_intf_pins udpAppMux_0/rxMetadataOutDhcp] [get_bd_intf_pins dhcp_client_0/s_axis_rx_metadata]
connect_bd_intf_net [get_bd_intf_pins udpAppMux_0/txDataInDhcp] [get_bd_intf_pins dhcp_client_0/m_axis_tx_data]
connect_bd_intf_net [get_bd_intf_pins udpAppMux_0/txLengthInDhcp] [get_bd_intf_pins dhcp_client_0/m_axis_tx_length]
connect_bd_intf_net [get_bd_intf_pins dhcp_client_0/m_axis_tx_metadata] [get_bd_intf_pins udpAppMux_0/txMetadataInDhcp]
connect_bd_intf_net [get_bd_intf_pins icmp_server_0/dataOut] [get_bd_intf_pins ip_merger/S00_AXIS]
connect_bd_intf_net [get_bd_intf_pins mac_ip_encode_0/dataIn] [get_bd_intf_pins ip_merger/M00_AXIS]
connect_bd_intf_net [get_bd_intf_pins toe_0/m_axis_tcp_data] [get_bd_intf_pins ip_merger/S02_AXIS]
connect_bd_intf_net [get_bd_intf_pins toe_0/m_axis_tcp_data] [get_bd_intf_pins m_axis_tcp_data]
connect_bd_intf_net [get_bd_intf_pins SmartCamCtl_wrapper_0/axis_lup_rsp] [get_bd_intf_pins toe_0/s_axis_session_lup_rsp]
connect_bd_intf_net [get_bd_intf_pins SmartCamCtl_wrapper_0/axi_udp_rsp] [get_bd_intf_pins toe_0/s_axis_session_upd_rsp]
connect_bd_intf_net [get_bd_intf_pins SmartCamCtl_wrapper_0/axis_lup_req] [get_bd_intf_pins toe_0/m_axis_session_lup_req]
connect_bd_intf_net [get_bd_intf_pins SmartCamCtl_wrapper_0/axi_udp_req] [get_bd_intf_pins toe_0/m_axis_session_upd_req]
connect_bd_intf_net [get_bd_intf_pins m_axis_rxread_cmd] [get_bd_intf_pins toe_0/m_axis_rxread_cmd]
connect_bd_intf_net [get_bd_intf_pins m_axis_rx_data] [get_bd_intf_pins toe_0/m_axis_rx_data_rsp]
connect_bd_intf_net [get_bd_intf_pins m_axis_rx_metadata] [get_bd_intf_pins toe_0/m_axis_rx_data_rsp_metadata]
connect_bd_intf_net [get_bd_intf_pins m_axis_open_status] [get_bd_intf_pins toe_0/m_axis_open_conn_rsp]
connect_bd_intf_net [get_bd_intf_pins m_axis_notifications] [get_bd_intf_pins toe_0/m_axis_notification]
connect_bd_intf_net [get_bd_intf_pins m_axis_listen_port_status] [get_bd_intf_pins toe_0/m_axis_listen_port_rsp]
connect_bd_intf_net [get_bd_intf_pins s_axis_txwrite_sts] [get_bd_intf_pins toe_0/s_axis_txwrite_sts]
connect_bd_intf_net [get_bd_intf_pins s_axis_tx_data_metadata] [get_bd_intf_pins toe_0/s_axis_tx_data_req_metadata]
connect_bd_intf_net [get_bd_intf_pins m_axis_txwrite_data] [get_bd_intf_pins toe_0/m_axis_txwrite_data]
connect_bd_intf_net [get_bd_intf_pins m_axis_txwrite_cmd] [get_bd_intf_pins toe_0/m_axis_txwrite_cmd]
connect_bd_intf_net [get_bd_intf_pins m_axis_txread_cmd] [get_bd_intf_pins toe_0/m_axis_txread_cmd]
connect_bd_intf_net [get_bd_intf_pins m_axis_tx_status] [get_bd_intf_pins toe_0/m_axis_tx_data_rsp]
connect_bd_intf_net [get_bd_intf_pins m_axis_rxwrite_data] [get_bd_intf_pins toe_0/m_axis_rxwrite_data]
connect_bd_intf_net [get_bd_intf_pins m_axis_rxwrite_cmd] [get_bd_intf_pins toe_0/m_axis_rxwrite_cmd]
connect_bd_intf_net [get_bd_intf_pins IbRxMetadataIn] [get_bd_intf_pins udpAppMux_0/rxMetadataOutApp]
connect_bd_intf_net [get_bd_intf_pins IbRxDataIn] [get_bd_intf_pins udpAppMux_0/rxDataOutApp]
connect_bd_intf_net [get_bd_intf_pins IbPortOpenReplyIn] [get_bd_intf_pins udpAppMux_0/portOpenReplyOutApp]
connect_bd_intf_net [get_bd_intf_pins IbTxMetadataOut] [get_bd_intf_pins udpAppMux_0/txMetadataInApp]
connect_bd_intf_net [get_bd_intf_pins IbTxLengthOut] [get_bd_intf_pins udpAppMux_0/txLengthInApp]
connect_bd_intf_net [get_bd_intf_pins IbTxDataOut] [get_bd_intf_pins udpAppMux_0/txDataInApp]
connect_bd_intf_net [get_bd_intf_pins IbRequestPortOpenOut] [get_bd_intf_pins udpAppMux_0/requestPortOpenInApp]
connect_bd_intf_net [get_bd_intf_pins s_axis_txread_data] [get_bd_intf_pins toe_0/s_axis_txread_data]
connect_bd_intf_net [get_bd_intf_pins s_axis_tx_data] [get_bd_intf_pins toe_0/s_axis_tx_data_req]
connect_bd_intf_net [get_bd_intf_pins s_axis_rxwrite_sts] [get_bd_intf_pins toe_0/s_axis_rxwrite_sts]
connect_bd_intf_net [get_bd_intf_pins s_axis_rxread_data] [get_bd_intf_pins toe_0/s_axis_rxread_data]
connect_bd_intf_net [get_bd_intf_pins s_axis_read_package] [get_bd_intf_pins toe_0/s_axis_rx_data_req]
connect_bd_intf_net [get_bd_intf_pins s_axis_open_connection] [get_bd_intf_pins toe_0/s_axis_open_conn_req]
connect_bd_intf_net [get_bd_intf_pins s_axis_listen_port] [get_bd_intf_pins toe_0/s_axis_listen_port_req]
connect_bd_intf_net [get_bd_intf_pins s_axis_close_connection] [get_bd_intf_pins toe_0/s_axis_close_conn_req]
connect_bd_intf_net [get_bd_intf_pins AXI_M_Stream] [get_bd_intf_pins mac_merger/M00_AXIS]
connect_bd_intf_net [get_bd_intf_pins dataIn] [get_bd_intf_pins ip_handler_0/dataIn]
connect_bd_net -net S00_ARB_REQ_SUPPRESS_1 [get_bd_pins gnd1/dout] \
  [get_bd_pins mac_merger/S00_ARB_REQ_SUPPRESS] [get_bd_pins mac_merger/S01_ARB_REQ_SUPPRESS]
connect_bd_net -net gnd_dout [get_bd_pins gnd0/dout] \
  [get_bd_pins udp_0/portRelease_TVALID] [get_bd_pins ip_merger/S00_ARB_REQ_SUPPRESS] \
  [get_bd_pins ip_merger/S01_ARB_REQ_SUPPRESS] [get_bd_pins ip_merger/S02_ARB_REQ_SUPPRESS]
connect_bd_net [get_bd_pins regDefaultGateway/dout] [get_bd_pins mac_ip_encode_0/regDefaultGateway_V]
connect_bd_net [get_bd_pins regSubNetMask/dout] [get_bd_pins mac_ip_encode_0/regSubNetMask_V]
connect_bd_net [get_bd_pins aresetn] \
  [get_bd_pins dhcp_client_0/aresetn] [get_bd_pins udpAppMux_0/aresetn] [get_bd_pins udp_0/aresetn] \
  [get_bd_pins icmp_server_0/ap_rst_n] [get_bd_pins axis_register_icmp_in_slice/aresetn] [get_bd_pins ip_handler_0/ap_rst_n] \
  [get_bd_pins axis_register_arp_in_slice/aresetn] [get_bd_pins toe_0/aresetn] [get_bd_pins mac_ip_encode_0/ap_rst_n] \
  [get_bd_pins arpServerWrapper_0/aresetn] [get_bd_pins SmartCamCtl_wrapper_0/aresetn] [get_bd_pins ip_merger/ARESETN] \
  [get_bd_pins ip_merger/S00_AXIS_ARESETN] [get_bd_pins ip_merger/M00_AXIS_ARESETN] [get_bd_pins ip_merger/S01_AXIS_ARESETN] \
  [get_bd_pins ip_merger/S02_AXIS_ARESETN] [get_bd_pins mac_merger/ARESETN] [get_bd_pins mac_merger/S00_AXIS_ARESETN] \
  [get_bd_pins mac_merger/M00_AXIS_ARESETN] [get_bd_pins mac_merger/S01_AXIS_ARESETN]
connect_bd_net [get_bd_pins aclk] \
  [get_bd_pins dhcp_client_0/aclk] [get_bd_pins udpAppMux_0/aclk] [get_bd_pins udp_0/aclk] [get_bd_pins icmp_server_0/ap_clk] \
  [get_bd_pins axis_register_icmp_in_slice/aclk] [get_bd_pins ip_handler_0/ap_clk] \
  [get_bd_pins axis_register_arp_in_slice/aclk] [get_bd_pins toe_0/aclk] [get_bd_pins mac_ip_encode_0/ap_clk] \
  [get_bd_pins arpServerWrapper_0/aclk] [get_bd_pins SmartCamCtl_wrapper_0/aclk] [get_bd_pins ip_merger/ACLK] \
  [get_bd_pins ip_merger/S00_AXIS_ACLK] [get_bd_pins ip_merger/M00_AXIS_ACLK] [get_bd_pins ip_merger/S01_AXIS_ACLK] \
  [get_bd_pins ip_merger/S02_AXIS_ACLK] [get_bd_pins mac_merger/ACLK] [get_bd_pins mac_merger/S00_AXIS_ACLK] \
  [get_bd_pins mac_merger/M00_AXIS_ACLK] [get_bd_pins mac_merger/S01_AXIS_ACLK]
connect_bd_net [get_bd_pins myMacAddress_V] \
  [get_bd_pins dhcp_client_0/myMacAddress_V] [get_bd_pins mac_ip_encode_0/myMacAddress_V] \
  [get_bd_pins ip_handler_0/myMacAddress_V] [get_bd_pins arpServerWrapper_0/myMacAddress]
connect_bd_net -net dhcpEnable_V_1 [get_bd_pins dhcpEnable] [get_bd_pins dhcp_client_0/dhcpEnable_V]
connect_bd_net [get_bd_pins toe_0/relSessionCount_V] [get_bd_pins relSessionCount]
connect_bd_net -net inputIpAddress_V_1 [get_bd_pins ip] \
  [get_bd_pins dhcp_client_0/inputIpAddress_V] [get_bd_pins toe_0/regIpAddress_V] [get_bd_pins ip_handler_0/regIpAddress_V] \
  [get_bd_pins arpServerWrapper_0/myIpAddress]
connect_bd_net [get_bd_pins toe_0/regSessionCount_V] [get_bd_pins regSessionCount]
connect_bd_net [get_bd_pins xlconstant_0/dout] [get_bd_pins udp_0/portRelease_TDATA]

current_bd_instance /network
connect_bd_intf_net [get_bd_intf_pins tx_register_slice_0/M_AXIS] [get_bd_intf_pins axi_10g_ethernet_0/s_axis_tx]
connect_bd_intf_net [get_bd_intf_pins axi_10g_ethernet_0/m_axis_rx] [get_bd_intf_pins rx_register_slice_1/S_AXIS]
connect_bd_intf_net [get_bd_intf_pins rx_register_slice_1/M_AXIS] [get_bd_intf_pins rx_data_fifo_1/S_AXIS]
connect_bd_intf_net [get_bd_intf_pins tx_data_fifo_0/M_AXIS] [get_bd_intf_pins tx_register_slice_0/S_AXIS]
connect_bd_intf_net [get_bd_intf_pins S_AXIS] [get_bd_intf_pins tx_data_fifo_0/S_AXIS]
connect_bd_intf_net [get_bd_intf_pins M_AXIS] [get_bd_intf_pins rx_data_fifo_1/M_AXIS]
connect_bd_net [get_bd_pins gnd/dout] \
  [get_bd_pins axi_10g_ethernet_0/s_axis_pause_tvalid] [get_bd_pins axi_10g_ethernet_0/tx_fault] \
  [get_bd_pins axi_10g_ethernet_0/sim_speedup_control]
connect_bd_net [get_bd_pins ifg_delay/dout] [get_bd_pins axi_10g_ethernet_0/tx_ifg_delay]
connect_bd_net [get_bd_pins vcc/dout] [get_bd_pins axi_10g_ethernet_0/signal_detect]
connect_bd_net [get_bd_pins tx_ifg_tuser/dout] [get_bd_pins axi_10g_ethernet_0/s_axis_pause_tdata]
connect_bd_net [get_bd_pins mac_config_vector/dout] \
  [get_bd_pins axi_10g_ethernet_0/mac_tx_configuration_vector] [get_bd_pins axi_10g_ethernet_0/mac_rx_configuration_vector]
connect_bd_net [get_bd_pins pcs_config_vector/dout] [get_bd_pins axi_10g_ethernet_0/pcs_pma_configuration_vector]
connect_bd_net [get_bd_pins rxn] [get_bd_pins axi_10g_ethernet_0/rxn]
connect_bd_net -net dclk_1 [get_bd_pins clk_100] [get_bd_pins axi_10g_ethernet_0/dclk]
connect_bd_net [get_bd_pins rxp] [get_bd_pins axi_10g_ethernet_0/rxp]
connect_bd_net [get_bd_pins axi_10g_ethernet_0/txusrclk2_out] \
  [get_bd_pins clk_156] [get_bd_pins rx_register_slice_1/aclk] [get_bd_pins tx_register_slice_0/aclk] \
  [get_bd_pins rx_data_fifo_1/s_axis_aclk] [get_bd_pins tx_data_fifo_0/s_axis_aclk]
connect_bd_net -net tx_axis_aresetn_1 [get_bd_pins aresetn] \
  [get_bd_pins axi_10g_ethernet_0/tx_axis_aresetn] [get_bd_pins axi_10g_ethernet_0/rx_axis_aresetn] \
  [get_bd_pins rx_register_slice_1/aresetn] [get_bd_pins tx_register_slice_0/aresetn] \
  [get_bd_pins rx_data_fifo_1/s_axis_aresetn] [get_bd_pins tx_data_fifo_0/s_axis_aresetn]
connect_bd_net [get_bd_pins refclk_n] [get_bd_pins axi_10g_ethernet_0/refclk_n]
connect_bd_net [get_bd_pins axi_10g_ethernet_0/txp] [get_bd_pins txp]
connect_bd_net [get_bd_pins axi_10g_ethernet_0/txn] [get_bd_pins txn]
connect_bd_net [get_bd_pins axi_10g_ethernet_0/resetdone_out] [get_bd_pins network_reset_done]
connect_bd_net [get_bd_pins refclk_p] [get_bd_pins axi_10g_ethernet_0/refclk_p]
connect_bd_net [get_bd_pins reset] [get_bd_pins axi_10g_ethernet_0/reset]
connect_bd_net [get_bd_pins axi_10g_ethernet_0/tx_statistics_valid] [get_bd_pins tx_statistics_valid]
connect_bd_net [get_bd_pins axi_10g_ethernet_0/tx_statistics_vector] [get_bd_pins tx_statistics_vector]
connect_bd_net [get_bd_pins axi_10g_ethernet_0/rx_statistics_valid] [get_bd_pins rx_statistics_valid]
connect_bd_net [get_bd_pins axi_10g_ethernet_0/rx_statistics_vector] [get_bd_pins rx_statistics_vector]

current_bd_instance /mem_interface
connect_bd_intf_net [get_bd_intf_pins ddr4_bank_0/C0_DDR4_S_AXI] [get_bd_intf_pins toe_switch/M00_AXI]
connect_bd_intf_net [get_bd_intf_pins ddr4_bank_0/C0_DDR4_S_AXI] [get_bd_intf_pins C0_DDR4_S_AXI]
connect_bd_intf_net [get_bd_intf_pins toeTX_data_mover/M_AXI_S2MM] [get_bd_intf_pins toe_switch/S03_AXI]
connect_bd_intf_net [get_bd_intf_pins toeTX_data_mover/M_AXI_MM2S] [get_bd_intf_pins toe_switch/S02_AXI]
connect_bd_intf_net [get_bd_intf_pins toeRx_data_mover/M_AXI_S2MM] [get_bd_intf_pins toe_switch/S01_AXI]
connect_bd_intf_net [get_bd_intf_pins toeRx_data_mover/M_AXI_MM2S] [get_bd_intf_pins toe_switch/S00_AXI]
connect_bd_intf_net [get_bd_intf_pins ddr4_bank_1/C0_DDR4_S_AXI] [get_bd_intf_pins PCIe_interconnect/M00_AXI]
connect_bd_intf_net [get_bd_intf_pins teoTX_m_axis_read] [get_bd_intf_pins toeRx_data_mover/M_AXIS_MM2S]
connect_bd_intf_net [get_bd_intf_pins toeTX_m_axis_read_sts] [get_bd_intf_pins toeRx_data_mover/M_AXIS_MM2S_STS]
connect_bd_intf_net [get_bd_intf_pins toeTX_s_axis_read_cmd] [get_bd_intf_pins toeRx_data_mover/S_AXIS_MM2S_CMD]
connect_bd_intf_net [get_bd_intf_pins toeTX_m_axis_write_sts] [get_bd_intf_pins toeRx_data_mover/M_AXIS_S2MM_STS]
connect_bd_intf_net [get_bd_intf_pins toeTx_s_axis_write_cmd] [get_bd_intf_pins toeRx_data_mover/S_AXIS_S2MM_CMD]
connect_bd_intf_net [get_bd_intf_pins toeTX_s_axis_write] [get_bd_intf_pins toeRx_data_mover/S_AXIS_S2MM]
connect_bd_intf_net [get_bd_intf_pins teo_RX_m_axis_read] [get_bd_intf_pins toeTX_data_mover/M_AXIS_MM2S]
connect_bd_intf_net [get_bd_intf_pins toeRX_m_axis_read_sts] [get_bd_intf_pins toeTX_data_mover/M_AXIS_MM2S_STS]
connect_bd_intf_net [get_bd_intf_pins toeRx_s_axis_read_cmd] [get_bd_intf_pins toeTX_data_mover/S_AXIS_MM2S_CMD]
connect_bd_intf_net [get_bd_intf_pins toeRX_m_axis_write_sts] [get_bd_intf_pins toeTX_data_mover/M_AXIS_S2MM_STS]
connect_bd_intf_net [get_bd_intf_pins toeRX_s_axis_write_cmd] [get_bd_intf_pins toeTX_data_mover/S_AXIS_S2MM_CMD]
connect_bd_intf_net [get_bd_intf_pins toeRx_s_axis_write] [get_bd_intf_pins toeTX_data_mover/S_AXIS_S2MM]
connect_bd_intf_net [get_bd_intf_pins S00_AXI] [get_bd_intf_pins PCIe_interconnect/S00_AXI]
connect_bd_intf_net [get_bd_intf_pins S01_AXI] [get_bd_intf_pins PCIe_interconnect/S01_AXI]
connect_bd_intf_net [get_bd_intf_pins S02_AXI] [get_bd_intf_pins PCIe_interconnect/S02_AXI]
connect_bd_intf_net [get_bd_intf_pins S03_AXI] [get_bd_intf_pins PCIe_interconnect/S03_AXI]
connect_bd_net -net m_axi_mm2s_aclk_1 [get_bd_pins clk156_25] \
  [get_bd_pins toeRx_data_mover/m_axi_mm2s_aclk] [get_bd_pins toeRx_data_mover/m_axis_s2mm_cmdsts_awclk] \
  [get_bd_pins toeRx_data_mover/m_axi_s2mm_aclk] [get_bd_pins toeRx_data_mover/m_axis_mm2s_cmdsts_aclk] \
  [get_bd_pins toeTX_data_mover/m_axi_mm2s_aclk] [get_bd_pins toeTX_data_mover/m_axis_s2mm_cmdsts_awclk] \
  [get_bd_pins toeTX_data_mover/m_axi_s2mm_aclk] [get_bd_pins toeTX_data_mover/m_axis_mm2s_cmdsts_aclk] \
  [get_bd_pins toe_switch/ACLK] [get_bd_pins toe_switch/S03_ACLK] [get_bd_pins toe_switch/S02_ACLK] \
  [get_bd_pins toe_switch/S00_ACLK] [get_bd_pins toe_switch/S01_ACLK] [get_bd_pins PCIe_interconnect/ACLK] \
  [get_bd_pins PCIe_interconnect/S01_ACLK] [get_bd_pins PCIe_interconnect/S02_ACLK] [get_bd_pins PCIe_interconnect/S03_ACLK]
connect_bd_net [get_bd_pins m_axi_mm2s_aresetn] \
  [get_bd_pins toeRx_data_mover/m_axi_mm2s_aresetn] [get_bd_pins toeRx_data_mover/m_axis_s2mm_cmdsts_aresetn] \
  [get_bd_pins toeRx_data_mover/m_axi_s2mm_aresetn] [get_bd_pins toeRx_data_mover/m_axis_mm2s_cmdsts_aresetn] \
  [get_bd_pins proc_sys_reset_1/ext_reset_in] [get_bd_pins proc_sys_reset_0/ext_reset_in] \
  [get_bd_pins toeTX_data_mover/m_axi_mm2s_aresetn] [get_bd_pins toeTX_data_mover/m_axis_s2mm_cmdsts_aresetn] \
  [get_bd_pins toeTX_data_mover/m_axi_s2mm_aresetn] [get_bd_pins toeTX_data_mover/m_axis_mm2s_cmdsts_aresetn] \
  [get_bd_pins toe_switch/ARESETN] [get_bd_pins toe_switch/S03_ARESETN] [get_bd_pins toe_switch/S02_ARESETN] \
  [get_bd_pins toe_switch/S00_ARESETN] [get_bd_pins toe_switch/S01_ARESETN] [get_bd_pins PCIe_interconnect/ARESETN] \
  [get_bd_pins PCIe_interconnect/S01_ARESETN] [get_bd_pins PCIe_interconnect/S02_ARESETN] \
  [get_bd_pins PCIe_interconnect/S03_ARESETN]
connect_bd_net -net ddr4_bank_1_c0_ddr4_act_n [get_bd_pins ddr4_bank_0/c0_ddr4_act_n] [get_bd_pins c0_ddr4_act_n]
connect_bd_net -net ddr4_bank_1_c0_ddr4_bg [get_bd_pins ddr4_bank_0/c0_ddr4_bg] [get_bd_pins c0_ddr4_bg]
connect_bd_net -net ddr4_bank_1_c0_ddr4_reset_n [get_bd_pins ddr4_bank_0/c0_ddr4_reset_n] [get_bd_pins c0_ddr4_reset_n]
connect_bd_net -net ddr4_bank_1_c0_ddr4_ba [get_bd_pins ddr4_bank_0/c0_ddr4_ba] [get_bd_pins c0_ddr4_ba]
connect_bd_net -net ddr4_bank_1_c0_ddr4_odt [get_bd_pins ddr4_bank_0/c0_ddr4_odt] [get_bd_pins c0_ddr4_odt]
connect_bd_net -net ddr4_bank_1_c0_ddr4_adr [get_bd_pins ddr4_bank_0/c0_ddr4_adr] [get_bd_pins c0_ddr4_adr]
connect_bd_net -net ddr4_bank_1_c0_ddr4_cs_n [get_bd_pins ddr4_bank_0/c0_ddr4_cs_n] [get_bd_pins c0_ddr4_cs_n]
connect_bd_net -net ddr4_bank_1_c0_ddr4_cke [get_bd_pins ddr4_bank_0/c0_ddr4_cke] [get_bd_pins c0_ddr4_cke]
connect_bd_net -net ddr4_bank_1_c0_ddr4_ck_t [get_bd_pins ddr4_bank_0/c0_ddr4_ck_t] [get_bd_pins c0_ddr4_ck_t]
connect_bd_net -net ddr4_bank_1_c0_ddr4_ck_c [get_bd_pins ddr4_bank_0/c0_ddr4_ck_c] [get_bd_pins c0_ddr4_ck_c]
connect_bd_net [get_bd_pins c0_ddr4_dqs_t] [get_bd_pins ddr4_bank_0/c0_ddr4_dqs_t]
connect_bd_net [get_bd_pins c0_ddr4_dqs_c] [get_bd_pins ddr4_bank_0/c0_ddr4_dqs_c]
connect_bd_net [get_bd_pins c0_ddr4_dq] [get_bd_pins ddr4_bank_0/c0_ddr4_dq]
connect_bd_net [get_bd_pins c0_ddr4_dm_dbi_n] [get_bd_pins ddr4_bank_0/c0_ddr4_dm_dbi_n]
connect_bd_net -net ddr4_bank_0_c0_ddr4_bg [get_bd_pins ddr4_bank_1/c0_ddr4_bg] [get_bd_pins c1_ddr4_bg]
connect_bd_net -net ddr4_bank_0_c0_ddr4_ba [get_bd_pins ddr4_bank_1/c0_ddr4_ba] [get_bd_pins c1_ddr4_ba]
connect_bd_net -net ddr4_bank_0_c0_ddr4_odt [get_bd_pins ddr4_bank_1/c0_ddr4_odt] [get_bd_pins c1_ddr4_odt]
connect_bd_net -net ddr4_bank_0_c0_ddr4_adr [get_bd_pins ddr4_bank_1/c0_ddr4_adr] [get_bd_pins c1_ddr4_adr]
connect_bd_net -net ddr4_bank_0_c0_ddr4_act_n [get_bd_pins ddr4_bank_1/c0_ddr4_act_n] [get_bd_pins c1_ddr4_act_n]
connect_bd_net -net ddr4_bank_0_c0_ddr4_cs_n [get_bd_pins ddr4_bank_1/c0_ddr4_cs_n] [get_bd_pins c1_ddr4_cs_n]
connect_bd_net -net ddr4_bank_0_c0_ddr4_cke [get_bd_pins ddr4_bank_1/c0_ddr4_cke] [get_bd_pins c1_ddr4_cke]
connect_bd_net -net ddr4_bank_0_c0_ddr4_ck_t [get_bd_pins ddr4_bank_1/c0_ddr4_ck_t] [get_bd_pins c1_ddr4_ck_t]
connect_bd_net -net ddr4_bank_0_c0_ddr4_ck_c [get_bd_pins ddr4_bank_1/c0_ddr4_ck_c] [get_bd_pins c1_ddr4_ck_c]
connect_bd_net [get_bd_pins c1_ddr4_dqs_t] [get_bd_pins ddr4_bank_1/c0_ddr4_dqs_t]
connect_bd_net [get_bd_pins c1_ddr4_dqs_c] [get_bd_pins ddr4_bank_1/c0_ddr4_dqs_c]
connect_bd_net [get_bd_pins c1_ddr4_dg] [get_bd_pins ddr4_bank_1/c0_ddr4_dq]
connect_bd_net [get_bd_pins c1_ddr4_dm_dbi_n] [get_bd_pins ddr4_bank_1/c0_ddr4_dm_dbi_n]
connect_bd_net -net ddr4_bank_0_c0_ddr4_reset_n [get_bd_pins ddr4_bank_1/c0_ddr4_reset_n] [get_bd_pins c1_ddr4_reset_n]
connect_bd_net [get_bd_pins sys_rst] [get_bd_pins ddr4_bank_0/sys_rst] [get_bd_pins ddr4_bank_1/sys_rst]
connect_bd_net -net c0_sys_clk_n_1 [get_bd_pins c1_sys_clk_n] [get_bd_pins ddr4_bank_1/c0_sys_clk_n]
connect_bd_net -net c0_sys_clk_p_1 [get_bd_pins c1_sys_clk_p] [get_bd_pins ddr4_bank_1/c0_sys_clk_p]
connect_bd_net [get_bd_pins c0_sys_clk_n] [get_bd_pins ddr4_bank_0/c0_sys_clk_n]
connect_bd_net [get_bd_pins c0_sys_clk_p] [get_bd_pins ddr4_bank_0/c0_sys_clk_p]
connect_bd_net -net proc_sys_reset_1_peripheral_aresetn [get_bd_pins proc_sys_reset_1/interconnect_aresetn] \
  [get_bd_pins ddr4_bank_1/c0_ddr4_aresetn] [get_bd_pins PCIe_interconnect/M00_ARESETN]
connect_bd_net [get_bd_pins ddr4_bank_1/c0_ddr4_ui_clk] [get_bd_pins proc_sys_reset_1/slowest_sync_clk] [get_bd_pins PCIe_interconnect/M00_ACLK]
connect_bd_net -net proc_sys_reset_0_peripheral_aresetn [get_bd_pins proc_sys_reset_0/interconnect_aresetn] \
  [get_bd_pins ddr4_bank_0/c0_ddr4_aresetn] [get_bd_pins toe_switch/M00_ARESETN]
connect_bd_net -net M00_ACLK_1 [get_bd_pins ddr4_bank_0/c0_ddr4_ui_clk] \
  [get_bd_pins c0_ddr4_ui_clk] [get_bd_pins proc_sys_reset_0/slowest_sync_clk] [get_bd_pins toe_switch/M00_ACLK]
connect_bd_net [get_bd_pins ddr4_bank_1/c0_ddr4_ui_clk_sync_rst] [get_bd_pins proc_sys_reset_1/aux_reset_in]
connect_bd_net [get_bd_pins ddr4_bank_0/c0_ddr4_ui_clk_sync_rst] [get_bd_pins proc_sys_reset_0/aux_reset_in]
connect_bd_net [get_bd_pins S00_ACLK] [get_bd_pins PCIe_interconnect/S00_ACLK]
connect_bd_net [get_bd_pins S00_ARESETN] [get_bd_pins PCIe_interconnect/S00_ARESETN]
